# Altium schematic sheet COMM.SchDoc
size A3; SheetNumber: 16; SheetTotal: 17
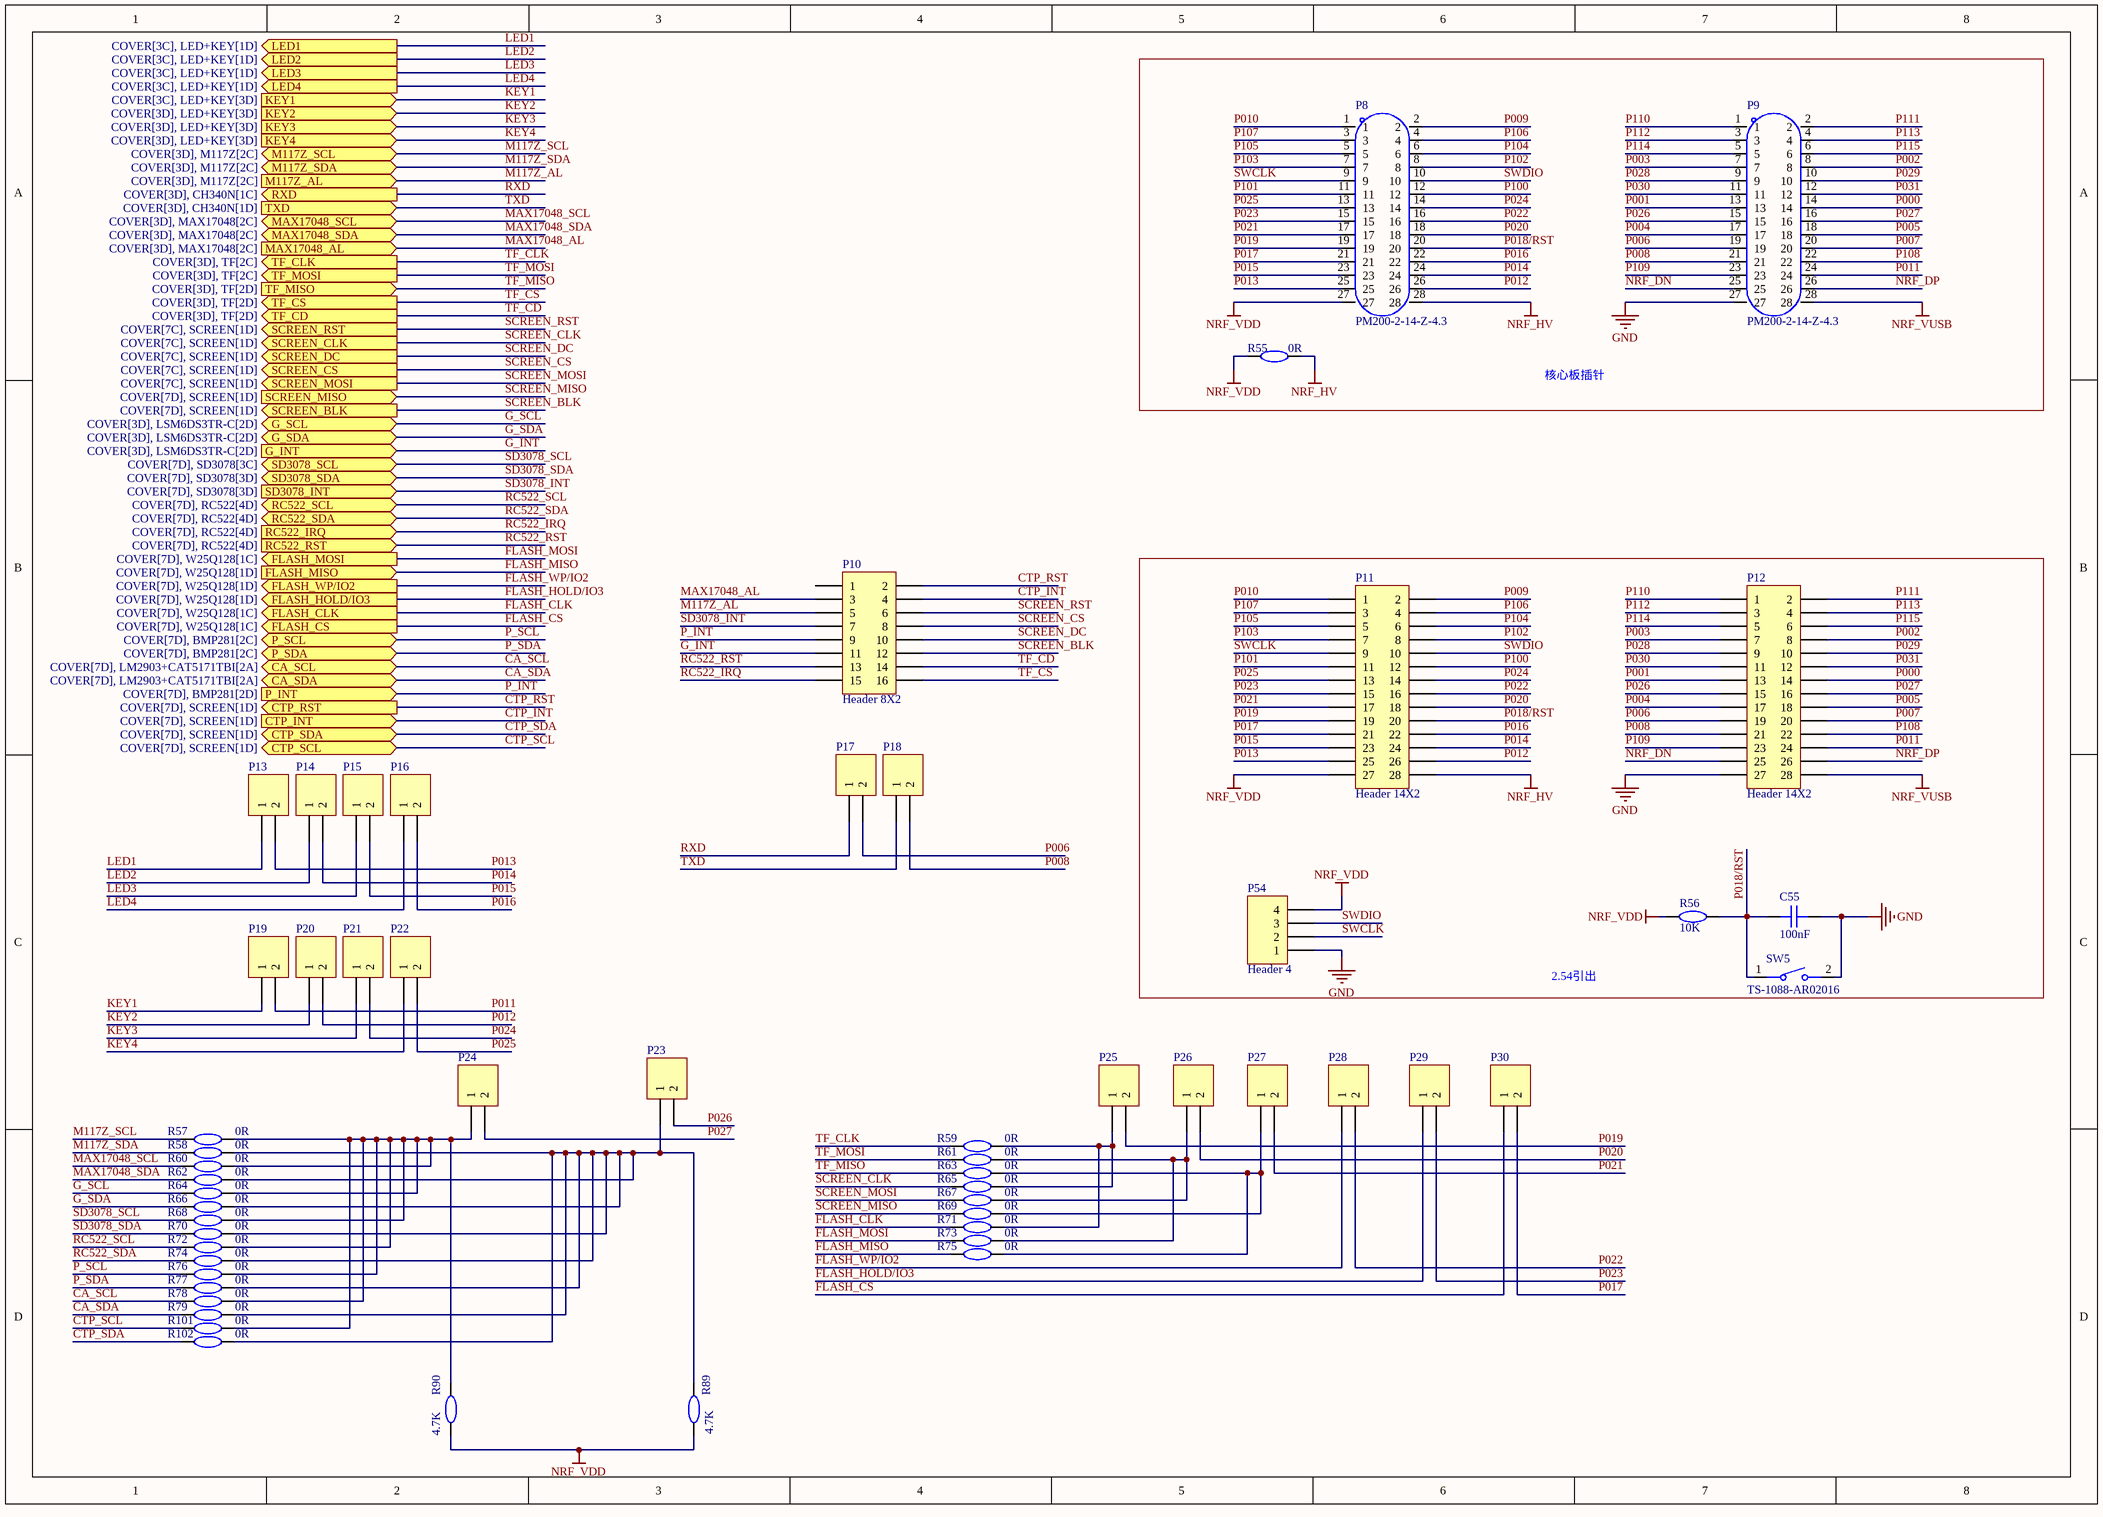
[diagram p0: COMM.SchDoc]

## Parts
C55  100nF  [C0402]
P8  PM200-2-14-Z-4.3  [HDR-TH_28P-P2.00-V-F-R2-C14-S2.00_MF200V-12-28-0590]
P9  PM200-2-14-Z-4.3  [HDR-TH_28P-P2.00-V-F-R2-C14-S2.00_MF200V-12-28-0590]
P10  Header 8X2  [HDR2X8]
P11  Header 14X2  [HDR2X14]
P12  Header 14X2  [HDR2X14]
P13  Header 2  [HDR1X2]  (value not drawn)
P14  Header 2  [HDR1X2]  (value not drawn)
P15  Header 2  [HDR1X2]  (value not drawn)
P16  Header 2  [HDR1X2]  (value not drawn)
P17  Header 2  [HDR1X2]  (value not drawn)
P18  Header 2  [HDR1X2]  (value not drawn)
P19  Header 2  [HDR1X2]  (value not drawn)
P20  Header 2  [HDR1X2]  (value not drawn)
P21  Header 2  [HDR1X2]  (value not drawn)
P22  Header 2  [HDR1X2]  (value not drawn)
P23  Header 2  [HDR1X2]  (value not drawn)
P24  Header 2  [HDR1X2]  (value not drawn)
P25  Header 2  [HDR1X2]  (value not drawn)
P26  Header 2  [HDR1X2]  (value not drawn)
P27  Header 2  [HDR1X2]  (value not drawn)
P28  Header 2  [HDR1X2]  (value not drawn)
P29  Header 2  [HDR1X2]  (value not drawn)
P30  Header 2  [HDR1X2]  (value not drawn)
P54  Header 4  [HDR1X4]
R55  0R  [R0402]
R56  10K  [R0402]
R57  0R  [R0402]
R58  0R  [R0402]
R59  0R  [R0402]
R60  0R  [R0402]
R61  0R  [R0402]
R62  0R  [R0402]
R63  0R  [R0402]
R64  0R  [R0402]
R65  0R  [R0402]
R66  0R  [R0402]
R67  0R  [R0402]
R68  0R  [R0402]
R69  0R  [R0402]
R70  0R  [R0402]
R71  0R  [R0402]
R72  0R  [R0402]
R73  0R  [R0402]
R74  0R  [R0402]
R75  0R  [R0402]
R76  0R  [R0402]
R77  0R  [R0402]
R78  0R  [R0402]
R79  0R  [R0402]
R89  4.7K  [R0402]
R90  4.7K  [R0402]
R101  0R  [R0402]
R102  0R  [R0402]
SW5  TS-1088-AR02016  [SW-SMD_L3.9-W3.0-P4.45]

## Blocks framed on the sheet
核心板插针: P8 P9 R55
2.54引出: C55 P11 P12 P54 R56 SW5

## Ports
CA_SCL (bidir, see COVER[7D], LM2903+CAT5171TBI[2A]), CA_SDA (bidir, see COVER[7D], LM2903+CAT5171TBI[2A]), CTP_INT (in, see COVER[7D], SCREEN[1D]), CTP_RST (out, see COVER[7D], SCREEN[1D]), CTP_SCL (bidir, see COVER[7D], SCREEN[1D]), CTP_SDA (bidir, see COVER[7D], SCREEN[1D]), FLASH_CLK (out, see COVER[7D], W25Q128[1C]), FLASH_CS (out, see COVER[7D], W25Q128[1C]), FLASH_HOLD/IO3 (out, see COVER[7D], W25Q128[1D]), FLASH_MISO (in, see COVER[7D], W25Q128[1D]), FLASH_MOSI (out, see COVER[7D], W25Q128[1C]), FLASH_WP/IO2 (out, see COVER[7D], W25Q128[1D]), G_INT (in, see COVER[3D], LSM6DS3TR-C[2D]), G_SCL (bidir, see COVER[3D], LSM6DS3TR-C[2D]), G_SDA (bidir, see COVER[3D], LSM6DS3TR-C[2D]), KEY1 (in, see COVER[3C], LED+KEY[3D]), KEY2 (in, see COVER[3D], LED+KEY[3D]), KEY3 (in, see COVER[3D], LED+KEY[3D]), KEY4 (in, see COVER[3D], LED+KEY[3D]), LED1 (out, see COVER[3C], LED+KEY[1D]), LED2 (out, see COVER[3C], LED+KEY[1D]), LED3 (out, see COVER[3C], LED+KEY[1D]), LED4 (out, see COVER[3C], LED+KEY[1D]), M117Z_AL (in, see COVER[3D], M117Z[2C]), M117Z_SCL (bidir, see COVER[3D], M117Z[2C]), M117Z_SDA (bidir, see COVER[3D], M117Z[2C]), MAX17048_AL (in, see COVER[3D], MAX17048[2C]), MAX17048_SCL (bidir, see COVER[3D], MAX17048[2C]), MAX17048_SDA (bidir, see COVER[3D], MAX17048[2C]), P_INT (in, see COVER[7D], BMP281[2D]), P_SCL (bidir, see COVER[7D], BMP281[2C]), P_SDA (bidir, see COVER[7D], BMP281[2C]), RC522_IRQ (in, see COVER[7D], RC522[4D]), RC522_RST (in, see COVER[7D], RC522[4D]), RC522_SCL (bidir, see COVER[7D], RC522[4D]), RC522_SDA (bidir, see COVER[7D], RC522[4D]), RXD (out, see COVER[3D], CH340N[1C]), SCREEN_BLK (out, see COVER[7D], SCREEN[1D]), SCREEN_CLK (out, see COVER[7C], SCREEN[1D]), SCREEN_CS (out, see COVER[7C], SCREEN[1D]), SCREEN_DC (out, see COVER[7C], SCREEN[1D]), SCREEN_MISO (in, see COVER[7D], SCREEN[1D]), SCREEN_MOSI (out, see COVER[7C], SCREEN[1D]), SCREEN_RST (out, see COVER[7C], SCREEN[1D]), SD3078_INT (in, see COVER[7D], SD3078[3D]), SD3078_SCL (bidir, see COVER[7D], SD3078[3C]), SD3078_SDA (bidir, see COVER[7D], SD3078[3D]), TF_CD (out, see COVER[3D], TF[2D]), TF_CLK (out, see COVER[3D], TF[2C]), TF_CS (out, see COVER[3D], TF[2D]), TF_MISO (in, see COVER[3D], TF[2D]), TF_MOSI (out, see COVER[3D], TF[2C]), TXD (in, see COVER[3D], CH340N[1D])

## Nets
GND: C55.2 P9.27 P12.27 P54.1 SW5.2
NRF_HV: P8.28 P11.28 R55.2
NRF_VDD: P8.27 P11.27 P54.4 R55.1 R56.1 R89.1 R90.1
NRF_VUSB: P9.28 P12.28
CA_SCL: R78.1 ; port CA_SCL
CA_SDA: R79.1 ; port CA_SDA
CTP_INT: P10.4 ; port CTP_INT
CTP_RST: P10.2 ; port CTP_RST
CTP_SCL: R101.1 ; port CTP_SCL
CTP_SDA: R102.1 ; port CTP_SDA
FLASH_CLK: R71.1 ; port FLASH_CLK
FLASH_CS: P30.1 ; port FLASH_CS
FLASH_HOLD/IO3: P29.1 ; port FLASH_HOLD/IO3
FLASH_MISO: R75.1 ; port FLASH_MISO
FLASH_MOSI: R73.1 ; port FLASH_MOSI
FLASH_WP/IO2: P28.1 ; port FLASH_WP/IO2
G_INT: P10.11 ; port G_INT
G_SCL: R64.1 ; port G_SCL
G_SDA: R66.1 ; port G_SDA
KEY1: P19.1 ; port KEY1
KEY2: P20.1 ; port KEY2
KEY3: P21.1 ; port KEY3
KEY4: P22.1 ; port KEY4
LED1: P13.1 ; port LED1
LED2: P14.1 ; port LED2
LED3: P15.1 ; port LED3
LED4: P16.1 ; port LED4
M117Z_AL: P10.5 ; port M117Z_AL
M117Z_SCL: R57.1 ; port M117Z_SCL
M117Z_SDA: R58.1 ; port M117Z_SDA
MAX17048_AL: P10.3 ; port MAX17048_AL
MAX17048_SCL: R60.1 ; port MAX17048_SCL
MAX17048_SDA: R62.1 ; port MAX17048_SDA
NRF_DN: P9.25 P12.25
NRF_DP: P9.26 P12.26
P000: P9.14 P12.14
P001: P9.13 P12.13
P002: P9.8 P12.8
P003: P9.7 P12.7
P004: P9.17 P12.17
P005: P9.18 P12.18
P006: P9.19 P12.19 P17.2
P007: P9.20 P12.20
P008: P9.21 P12.21 P18.2
P009: P8.2 P11.2
P010: P8.1 P11.1
P011: P9.24 P12.24 P19.2
P012: P8.26 P11.26 P20.2
P013: P8.25 P11.25 P13.2
P014: P8.24 P11.24 P14.2
P015: P8.23 P11.23 P15.2
P016: P8.22 P11.22 P16.2
P017: P8.21 P11.21 P30.2
P018/RST: C55.1 P8.20 P11.20 R56.2 SW5.1
P019: P8.19 P11.19 P25.2
P020: P8.18 P11.18 P26.2
P021: P8.17 P11.17 P27.2
P022: P8.16 P11.16 P28.2
P023: P8.15 P11.15 P29.2
P024: P8.14 P11.14 P21.2
P025: P8.13 P11.13 P22.2
P026: P9.15 P12.15 P23.2
P027: P9.16 P12.16 P24.2
P028: P9.9 P12.9
P029: P9.10 P12.10
P030: P9.11 P12.11
P031: P9.12 P12.12
P100: P8.12 P11.12
P101: P8.11 P11.11
P102: P8.8 P11.8
P103: P8.7 P11.7
P104: P8.6 P11.6
P105: P8.5 P11.5
P106: P8.4 P11.4
P107: P8.3 P11.3
P108: P9.22 P12.22
P109: P9.23 P12.23
P110: P9.1 P12.1
P111: P9.2 P12.2
P112: P9.3 P12.3
P113: P9.4 P12.4
P114: P9.5 P12.5
P115: P9.6 P12.6
P_INT: P10.9 ; port P_INT
P_SCL: R76.1 ; port P_SCL
P_SDA: R77.1 ; port P_SDA
RC522_IRQ: P10.15 ; port RC522_IRQ
RC522_RST: P10.13 ; port RC522_RST
RC522_SCL: R72.1 ; port RC522_SCL
RC522_SDA: R74.1 ; port RC522_SDA
RXD: P17.1 ; port RXD
SCREEN_BLK: P10.12 ; port SCREEN_BLK
SCREEN_CLK: R65.1 ; port SCREEN_CLK
SCREEN_CS: P10.8 ; port SCREEN_CS
SCREEN_DC: P10.10 ; port SCREEN_DC
SCREEN_MISO: R69.1 ; port SCREEN_MISO
SCREEN_MOSI: R67.1 ; port SCREEN_MOSI
SCREEN_RST: P10.6 ; port SCREEN_RST
SD3078_INT: P10.7 ; port SD3078_INT
SD3078_SCL: R68.1 ; port SD3078_SCL
SD3078_SDA: R70.1 ; port SD3078_SDA
SWCLK: P8.9 P11.9 P54.2
SWDIO: P8.10 P11.10 P54.3
TF_CD: P10.14 ; port TF_CD
TF_CLK: R59.1 ; port TF_CLK
TF_CS: P10.16 ; port TF_CS
TF_MISO: R63.1 ; port TF_MISO
TF_MOSI: R61.1 ; port TF_MOSI
TXD: P18.1 ; port TXD
NetP23_1: P23.1 R58.2 R62.2 R66.2 R70.2 R74.2 R77.2 R79.2 R89.2 R102.2
NetP24_1: P24.1 R57.2 R60.2 R64.2 R68.2 R72.2 R76.2 R78.2 R90.2 R101.2
NetP25_1: P25.1 R59.2 R65.2 R71.2
NetP26_1: P26.1 R61.2 R67.2 R73.2
NetP27_1: P27.1 R63.2 R69.2 R75.2

Not connected (* = marked no-connect by the designer): P10 1

## Library data of the parts
C55 = CAP_0402: Symbol: CapAcitance; Device: CAP_0603; Convert to PCB: yes; Add into BOM: yes; Supplier Footprint: 0603; Value: 100nF; Name: 100nF
P8 P9 = PM200-2-14-Z-4.3_C3012178: Manufacturer: HCTL(华灿天禄); Add into BOM: yes; Holes Structure: 2x14P; Pitch: 2mm; Circular Hole / Square Hole: 方孔; Number of Holes: 28P; Current Rating (Max): 1.5A; Holes Direction: 顶部; Symbol: PM200-2-14-Z-4.3_C3012178; Device: PM200-2-14-Z-4.3_C3012178; LCSC Part Name: 2x14P 间距:2mm 直插; Supplier Part: C3012178; Manufacturer Part: PM200-2-14-Z-4.3; Supplier Footprint: 插件,P=2mm; JLCPCB Part Class: 扩展库; Datasheet: https://atta.szlcsc.com/upload/public/pdf/source/20230609/7782803E9FC77B1812B983B108C615C3.pdf; Supplier: LCSC; Convert to PCB: yes; Row Spacing: 2mm; Mounting Type: 直插; Number of Rows: 双排; Insulation Height: 4.3mm; Contact Material: 黄铜; Operating Temperature Range: -40℃~+105℃; Name: PM200-2-14-Z-4.3
P10 = Header 8X2: Header, 8-Pin, Dual row; LatestRevisionDate: 17-Jul-2002; LatestRevisionNote: Re-released for DXP Platform.; Publisher: Altium Limited
P11 P12 = Header 14X2: Header, 14-Pin, Dual row; LatestRevisionDate: 17-Jul-2002; LatestRevisionNote: Re-released for DXP Platform.; Publisher: Altium Limited
P13-P30 = Header 2: Header, 2-Pin; LatestRevisionDate: 17-Jul-2002; LatestRevisionNote: Re-released for DXP Platform.; Publisher: Altium Limited
P54 = Header 4: Header, 4-Pin; LatestRevisionDate: 17-Jul-2002; LatestRevisionNote: Re-released for DXP Platform.; Publisher: Altium Limited
R55-R79 R89 R90 R101 R102 = Res_0402: Symbol: 电阻; Device: Res_0603; Convert to PCB: yes; Add into BOM: yes; Supplier Footprint: 0603
  R55 R57-R79 R101 R102: Value: 0R; Name: 0R
  R56: Value: 10K; Name: 10K
  R89 R90: Value: 4.7K; Name: 4.7K
SW5 = TS-1088-AR02016: Manufacturer: XUNPU(讯普); Add into BOM: yes; Circuit: 单刀单掷; Actuator Style: 圆形按钮; Operating Force: 160gf; Switch Length: 4mm; Switch Width: 3mm; Switch Height: 2mm; Strike Gundam: 不带; Contact Current: 50mA; Voltage Rating (DC): 12V; Insulation Resistance: 100MΩ; Actuator/Cap Color: 黑色; Pin Style: SMD接片; Mechanical Life: 10万次; Symbol: TS-1088-AR02016; Device: TS-1088-AR02016; LCSC Part Name: 4*3*2mm 立贴 轻触开关; Supplier Part: C720477; Manufacturer Part: TS-1088-AR02016; Supplier Footprint: SMD; Datasheet: https://atta.szlcsc.com/upload/public/pdf/source/20200810/C720475_60D09DD6C54279ADDB2DC25100F1CC11.pdf; Supplier: LCSC; Convert to PCB: yes; Mounting Style: 立贴; Operating Temperature: -30℃~+80℃; Name: TS-1088-AR02016